# Altium schematic sheet UART.SchDoc
size A4; Date: 08.06.2024; ApprovedBy: Jan Macheta; Author: Mikołaj Pichita; SheetNumber: 6; SheetTotal: 8
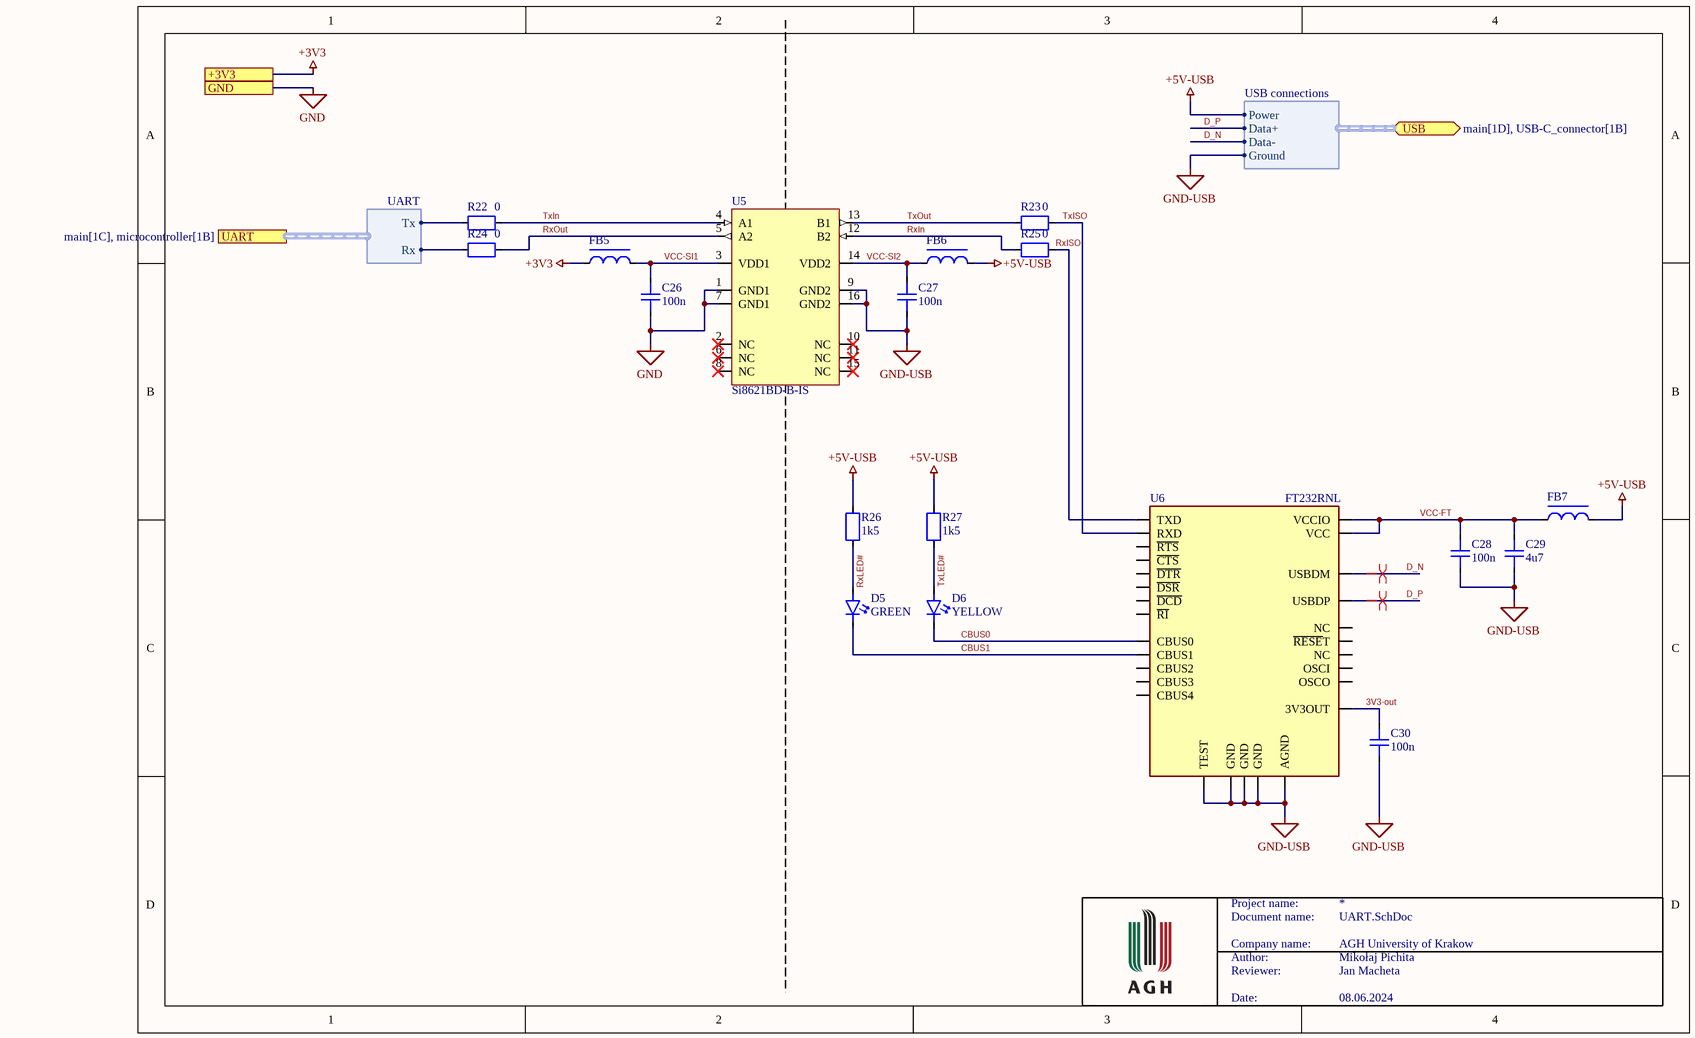
[diagram p0: UART.SchDoc]

## Parts
C26  100n  [CAP0603]
C27  100n  [CAP0603]
C28  100n  [CAP0603]
C29  4u7  [CAP0603]
C30  100n  [CAP0603]
D5  GREEN  [LED0603]
D6  YELLOW  [LED0603]
FB5  *  [FB0402]  (value not drawn)
FB6  *  [FB0402]  (value not drawn)
FB7  *  [FB0402]  (value not drawn)
R22  0  [RES0603]
R23  0  [RES0603]
R24  0  [RES0603]
R25  0  [RES0603]
R26  1k5  [RES0603]
R27  1k5  [RES0603]
U5  Si8621BD-B-IS  [SLAB-SOIC-16-WB_M]
U6  FT232RNL  [SOP65P780X200-28N]

## Ports
+3V3 (see main[1C], analog[4A], current_measurement[1C], microcontroller[4A], power[2A], voltage_measurement[4D]), GND (see main[1C], analog[4A], current_measurement[1C], microcontroller[4A], power[2B], voltage_measurement[4D]), UART (harness UART, see main[1C], microcontroller[1B]), USB (bidir, harness USB connections, see main[1D], USB-C_connector[1B])

## Harnesses
UART: Tx, Rx
USB connections: Power, Data+, Data-, Ground

## Nets
+3V3: FB5.1 ; port +3V3
+5V-USB: FB6.2 FB7.2 R26.1 R27.1 ; port USB.Power
GND: C26.2 U5.1(GND1) U5.7(GND1) ; port GND
GND-USB: C27.2 C28.2 C29.2 C30.2 U5.9(GND2) U5.16(GND2) U6.7(GND) U6.18(GND) U6.21(GND) U6.25(AGND) U6.26(TEST) ; port USB.Ground
3V3-out: C30.1 U6.17(3V3OUT)
CBUS0: D6.2 U6.23(CBUS0)
CBUS1: D5.2 U6.22(CBUS1)
D_N: U6.16(USBDM) ; port USB.Data-
D_P: U6.15(USBDP) ; port USB.Data+
RxIn: R25.2 U5.12(B2)
RxISO: R25.1 U6.1(TXD)
RxLED#: D5.1 R26.2
RxOut: R24.1 U5.5(A2)
TxIn: R22.1 U5.4(A1)
TxISO: R23.1 U6.5(RXD)
TxLED#: D6.1 R27.2
TxOut: R23.2 U5.13(B1)
VCC-FT: C28.1 C29.1 FB7.1 U6.4(VCCIO) U6.20(VCC)
VCC-SI1: C26.1 FB5.2 U5.3(VDD1)
VCC-SI2: C27.1 FB6.1 U5.14(VDD2)
NetR22_2: R22.2 ; port UART.Tx
NetR24_2: R24.2 ; port UART.Rx

Not connected (* = marked no-connect by the designer): U5 2(NC)* 6(NC)* 8(NC)* 10(NC)* 11(NC)* 15(NC)*; U6 2(~{DTR}) 3(~{RTS}) 6(~{RI}) 8(NC) 9(~{DSR}) 10(~{DCD}) 11(~{CTS}) 12(CBUS4) 13(CBUS2) 14(CBUS3) 19(~{RESE}T) 24(NC) 27(OSCI) 28(OSCO)

## Layout directives
differential pair: D_N, D_P

## Notes on the sheet
- Project name:
- Document name:
- Company name:
- Author:
- Reviewer:
- AGH University of Krakow
- Date:

## Library data of the parts
C26-C30 = Capacitor: Value: *; HelpURL: *; MPN: *; Supplier: *; SupplierPartNumber: *
D5 D6 = LED: Value: *; HelpURL: *; MPN: *; Supplier: *; SupplierPartNumber: *
FB5-FB7 = Ferrite Bead: Value: *; HelpURL: *; MPN: *; Supplier: *; SupplierPartNumber: *
R22-R27 = Resistor: Value: *; HelpURL: *; MPN: *; Supplier: *; SupplierPartNumber: *
U5 = Si8621BD-B-IS: Low-Power Single and Dual-Channel Digital Isolator, 150 Mbps, 5 kVRMS Isolation Rating, -40 to 125 degC, 16-pin SOIC; Manufacturer: Silicon Labs; Maximum Propagation Delay (ns): 13; Maximum Data Rate (Mbps): 150; Channel Type: Unidirectional; Enable Control: TRUE; AEC-Q100: FALSE; Sub-Family: Isolators; Isolation Rating (kV): 5; ComponentLink1URL: http://www.silabs.com/; ComponentLink2Description: Datasheet; ComponentLink1Description: Manufacturer URL; Mounting Technology: Surface Mount; Code_JEDEC: MS-013; 10kV surge: FALSE; ComponentLink3Description: Package Specification; PackageReference: SOIC-16-WB; ComponentLink2URL: http://www.silabs.com/Support%20Documents/TechnicalDocs/Si861x-2x.pdf; ComponentLink3URL: https://www.silabs.com/Support%20Documents/TechnicalDocs/Si823x.pdf; DatasheetVersion: Rev. 1.3; PartNumber: Si8621BD-B-IS; PackageDescription: 16-Pin Wide Body Plastic Small Outline, Body 10.3 x 7.5 mm, Pitch 1.27 mm
U6 = FT232RNL: USB Interface IC USB Full Speed to Serial UART IC, Includes Oscillator and EEPROM, SSOP-28; Value: *; HelpURL: *; MPN: *; Supplier: *; SupplierPartNumber: *